# Altium schematic sheet DEBUG.SchDoc: TAG Connector
size A4; Project: STM32H7-DK; Date: Not used; ApprovedBy: Not used; CheckedBy: Not used; Author: Not used; CompanyName: STMicroelectronics; DrawnBy: Not used; Engineer: Not used; Organization: Not used; Address1: Not used; Address2: Not used; Address3: Not used; Address4: Not used; DocumentNumber: Not used; Revision: Not used; SheetNumber: 13; SheetTotal: 16; CurrentTime: Not used; CurrentDate: Not used; Time: Not used; DocumentFullPathAndName: Not used; DocumentName: Not used; ModifiedDate: Not used; ImagePath: Not used; ProjectName: Not used; Application_BuildNumber: Not used
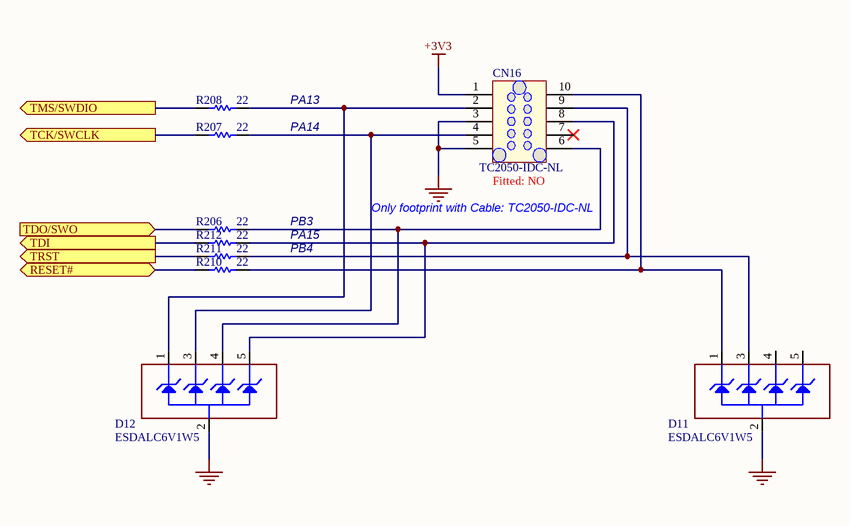
[diagram p0: DEBUG.SchDoc]

## Parts
CN16  TC2050-IDC-NL  Fitted: NO  [TC2050-IDC-NL]
D11  ESDALC6V1W5  [SC70-5]
D12  ESDALC6V1W5  [SC70-5]
R206  22  [0603R]
R207  22  [0603R]
R208  22  [0603R]
R210  22  [0603R]
R211  22  [0603R]
R212  22  [0603R]

## Ports
RESET# (bidir), TCK/SWCLK (out), TDI (out), TDO/SWO (in), TMS/SWDIO (out), TRST (out)

## Nets
+3V3: CN16.1
GND: CN16.3 CN16.5 D11.2(GND) D12.2(GND)
RESET#: R210.2 ; port RESET#
TCK/SWCLK: R207.2 ; port TCK/SWCLK
TDI: R212.2 ; port TDI
TDO/SWO: R206.2 ; port TDO/SWO
TMS/SWDIO: R208.2 ; port TMS/SWDIO
TRST: R211.2 ; port TRST
NetCN16_2: CN16.2 D12.1(IO1) R208.1
NetCN16_4: CN16.4 D12.3(IO2) R207.1
NetCN16_6: CN16.6 D12.4(IO3) R206.1
NetCN16_8: CN16.8 D12.5(IO4) R212.1
NetCN16_9: CN16.9 D11.3(IO2) R211.1
NetCN16_10: CN16.10 D11.1(IO1) R210.1

Not connected (* = marked no-connect by the designer): CN16 7*; D11 4(IO3) 5(IO4)

## Notes on the sheet
- PA13
- PA14
- PB3
- Only footprint with Cable: TC2050-IDC-NL
- PA15
- PB4
- Title:
- Project:
- Size:
- Revision:
- Variant:
- A4
- -
- Date:
- Reference:
- Sheet:
- of

## Library data of the parts
CN16 = Tag-10-C: Tag_Connector Header, 10-Pin, Dual row No legs; Manuf_Part_1: TC2050-IDC-NL-FP; Ordered_By: Subcon; Distrib: *; ECCN_US/EU: n/a; Manuf_1: Tag_connect; Order_code: *; Value: TC2050-IDC-NL; Ordered by: Subcon
D11 D12 = ESDALC6V1W5: Dual Transil array for ESD protection; Manuf_1: STM; Ref St: 9179034; Fitted: YES; ECCN_US/EU: EAR99/NEC; Manuf_Part_1: ESDALC6V1W5; Distrib: ST; Order: ESDALC6V1W5; Ordered by: STM
R206-R208 R210-R212 = Res1: Resistor; Value: 1K; Published: 8-Jun-2000; Revision: July-2002: Re-released for DXP Platform.; Publisher: Altium Limited